# Altium project H743-Feedback.PrjPcb (part 3 of 3)

## Sheet zp_zh.SchDoc: Plate Voltage Source
size OrCAD A; DocumentNumber: FB-001; Revision: A; SheetNumber: 4; SheetTotal: 5
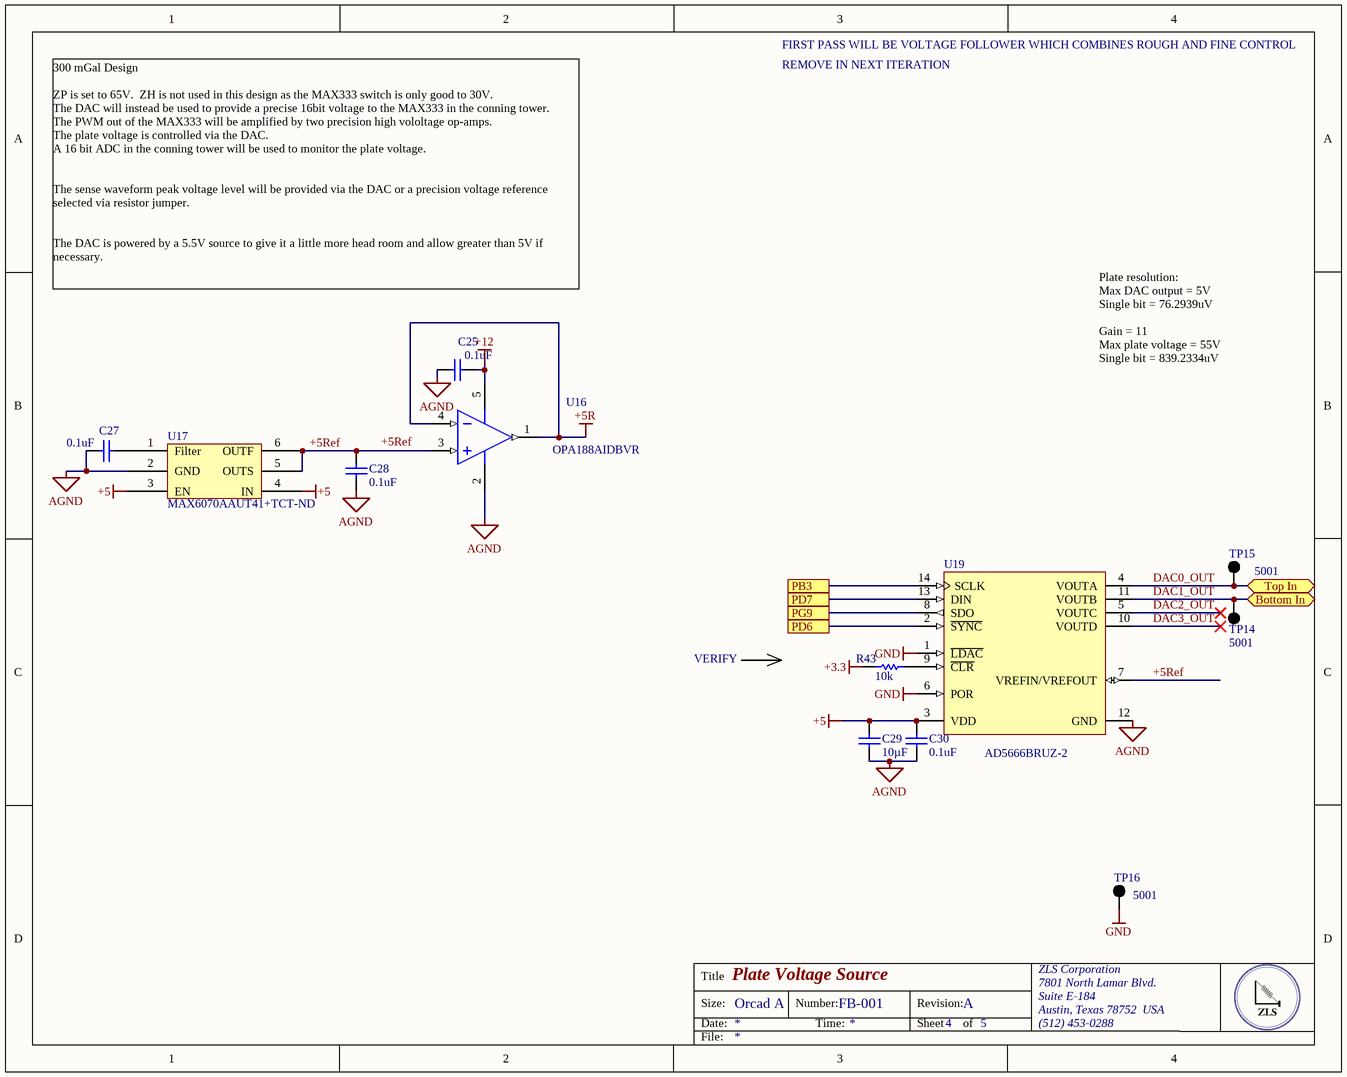
[diagram p3: zp_zh.SchDoc]

### Parts
C25  0.1uF  [CAPC0402(1005)60_L]
C27  0.1uF  [CAPC0402(1005)60_L]
C28  0.1uF  [CAPC0402(1005)60_L]
C29  Capacitance: 10µF  [CAPC0805(2012)145_N]  (hidden comment: 10uF)
C30  0.1uF  [CAPC0402(1005)60_L]
R43  10k  [RESC0402(1005)_M]
TP14  5001  [KSTN-5001]
TP15  5001  [KSTN-5001]
TP16  5001  [KSTN-5001]
U16  OPA188AIDBVR  [DBV0005A_M]
U17  Supplier Part Number 1: MAX6070AAUT41+TCT-ND  [SOT95P280X445-6N]  (hidden comment: MAX6070AAUT41+T)
U19  AD5666BRUZ-2  [RU-14_N]

### Ports
Bottom In (bidir), PB3, PD6, PD7, PG9, Top In (bidir)

### Nets
+3.3: R43.1
+5: C29.2 C30.1 U17.3(EN) U17.4(IN) U19.3(VDD)
+5R: U16.1(OUT) U16.4(IN-)
+12: C25.1 U16.5(V+)
AGND: C25.2 C27.2 C28.1 C29.1 C30.2 U16.2(V-) U17.2(GND) U19.12(GND)
GND: TP16.1 U19.1(~{LDAC}) U19.6(POR)
+5Ref: C28.2 U16.3(IN+) U17.5(OUTS) U17.6(OUTF) U19.7(VREFIN/VREFOUT)
DAC0_OUT: TP15.1 U19.4(VOUTA) ; port Top In
DAC1_OUT: TP14.1 U19.11(VOUTB) ; port Bottom In
DAC2_OUT: U19.5(VOUTC)
DAC3_OUT: U19.10(VOUTD)
PB3: U19.14(SCLK) ; port PB3
PD6: U19.2(~{SYNC}) ; port PD6
PD7: U19.13(DIN) ; port PD7
PG9: U19.8(SDO) ; port PG9
NetC27_1: C27.1 U17.1(Filter)
NetR43_2: R43.2 U19.9(~{CLR})

### Notes on the sheet
- FIRST PASS WILL BE VOLTAGE FOLLOWER WHICH COMBINES ROUGH AND FINE CONTROL
- REMOVE IN NEXT ITERATION
- 300 mGal Design
  ZP is set to 65V.  ZH is not used in this design as the MAX333 switch is only good to 30V.
  The DAC will instead be used to provide a precise 16bit voltage to the MAX333 in the conning tower.
  The PWM out of the MAX333 will be amplified by two precision high vololtage op-amps.
  The plate voltage is controlled via the DAC.
  A 16 bit ADC in the conning tower will be used to monitor the plate voltage.
  The sense waveform peak voltage level will be provided via the DAC or a precision voltage reference selected via resistor jumper.
  The DAC is powered by a 5.5V source to give it a little more head room and allow greater than 5V if necessary.
- Plate resolution:
  Max DAC output = 5V
  Single bit = 76.2939uV
  Gain = 11
  Max plate voltage = 55V
  Single bit = 839.2334uV
- VERIFY
- Labels drawn without touching a wire or pin: +5Ref
- Title
- Size:
- Date:
- Orcad A
- Number:
- Time:
- Revision:
- Sheet
- of
- ZLS Corporation
- 7801 North Lamar Blvd.
- Suite E-184
- Austin, Texas 78752  USA
- (512) 453-0288
- File:

### Library data of the parts
C25 C27 C28 C30 = CMP-1034-00252-1: CAP CER 0.1UF 10V X7R 0402; Manufacturer: Murata Electronics North America; Manufacturer Part Number: GRM155R71A104KA01D; Tolerance: ±10%; Supplier 1: Digi-Key; Supplier Part Number 1: 490-6321-1-ND; RoHS: RoHS Compliant; Category: Capacitors; Stock 1: 2920395; Pricing 1: 1=0.1, 10=0.014, 100=0.0063, 500=0.00446, 1000=0.00351, 2500=0.00319, 5000=0.00293 (USD); Packaging: Cut Tape (CT); Part Status: Active; Voltage - Rated: 10V; Temperature Coefficient: X7R; Operating Temperature: -55°C ~ 125°C; Features: -; Ratings: -; Applications: General Purpose; Mounting Type: Surface Mount, MLCC; Package / Case: 0402 (1005 Metric); Size / Dimension: 0.039" L x 0.020" W (1.00mm x 0.50mm); Height - Seated (Max): -; Thickness (Max): 0.022" (0.55mm); Lead Spacing: -; ComponentLink1URL: http://www.murata.com/~/media/webrenewal/support/library/catalog/products/capacitor/mlcc/c02e.ashx?la=en-us; ComponentLink1Description: http://www.murata.com/~/media/webrenewal/support/library/catalog/products/capacitor/mlcc/c02e.ashx?la=en-us
C29 = CMP-1036-04795-1: CAP CER 10UF 25V X7R 0805; Manufacturer: Murata Electronics North America; Manufacturer Part Number: GRM21BR71E104KA01L; Tolerance: ±10%; Supplier 1: Digi-Key; Supplier Part Number 1: 490-1673-6-ND; RoHS: RoHS Compliant; Category: Capacitors; Stock 1: 891652; Pricing 1: 1=0.2, 10=0.145, 100=0.0683, 500=0.04788, 1000=0.03964 (USD); Packaging: Digi-Reel®; Part Status: Active; Voltage - Rated: 25V; Temperature Coefficient: X7R; Operating Temperature: -55°C ~ 125°C; Features: -; Ratings: -; Applications: General Purpose; Mounting Type: Surface Mount, MLCC; Package / Case: 0805 (2012 Metric); Size / Dimension: 0.079" L x 0.049" W (2.00mm x 1.25mm); Height - Seated (Max): -; Thickness (Max): 0.053" (1.35mm); Lead Spacing: -; Lead Style: -; ComponentLink1URL: http://www.murata.com/~/media/webrenewal/support/library/catalog/products/capacitor/mlcc/c02e.ashx; ComponentLink1Description: http://www.murata.com/~/media/webrenewal/support/library/catalog/products/capacitor/mlcc/c02e.ashx
R43 = CMP-1011-00940-1: 10k 0.063W 1% 0402 (1005 Metric)  SMD; Manufacturer: Panasonic; Manufacturer Part Number: ERJ-2RKF1002X; Resistance: 10kR; Temperature Coefficient: 100ppm/°C; Power Rating: 100mW; Voltage Rating: 50V; Supplier 1: Digi-Key; Supplier Part Number 1: P10.0KLDKR-ND; Stock 1: 12501303; Pricing 1: 1=0.10000, 10=0.04500, 100=0.01830, 1000=0.00823, 2500=0.00715, 5000=0.00590 (USD); RoHS: Yes; Mount: Surface Mount; Case/Package: 0402; Number of Pins: 2; Case Code (Metric): 1005; Case Code (Imperial): 0402; Contact Plating: Tin; Min Operating Temperature: -55°C; Max Operating Temperature: 155°C; Tolerance: 1%; Packaging: Tape and Reel; Composition: Thick Film; Termination: SMD/SMT; Voltage Rating (DC): 50V; Package Quantity: 1; Number of Terminations: 2; Max Power Dissipation: 100mW; Military Standard: Not; Features: Automotive AEC-Q200; Length: 1mm; Height: 0.35mm; Width: 0.02inch; Depth: 0.5mm; Radiation Hardening: No; Lead Free: Lead Free; REACH SVHC: No SVHC; ComponentLink1URL: https://datasheet.ciiva.com/11821/0900766b80f80784-11821171.pdf?src-supplier=RSComponents; ComponentLink1Description: https://datasheet.ciiva.com/11821/0900766b80f80784-11821171.pdf?src-supplier=RSComponents; ComponentLink2URL: https://datasheet.ciiva.com/16199/aoa0000ce2-16199478.pdf?src-supplier=Future+Electronics; ComponentLink2Description: https://datasheet.ciiva.com/16199/aoa0000ce2-16199478.pdf?src-supplier=Future+Electronics; ComponentLink3URL: https://datasheet.ciiva.com/17212/aoa0000ce2-17212102.pdf?src-supplier=Avnet+Europe; ComponentLink3Description: https://datasheet.ciiva.com/17212/aoa0000ce2-17212102.pdf?src-supplier=Avnet+Europe; ComponentLink4URL: https://datasheet.ciiva.com/24023/aoa0000ce2-24023017.pdf?src-supplier=Mouser; ComponentLink4Description: https://datasheet.ciiva.com/24023/aoa0000ce2-24023017.pdf?src-supplier=Mouser; ComponentLink5URL: https://datasheet.ciiva.com/28514/1678782-28514185.pdf?src-supplier=Element14; ComponentLink5Description: https://datasheet.ciiva.com/28514/1678782-28514185.pdf?src-supplier=Element14; ComponentLink6URL: https://datasheet.ciiva.com/43467/1678782-43467402.pdf?src-supplier=Farnell; ComponentLink6Description: https://datasheet.ciiva.com/43467/1678782-43467402.pdf?src-supplier=Farnell; ComponentLink7URL: https://datasheet.ciiva.com/27055/1987020-27055643.pdf?src-supplier=Jameco; ComponentLink7Description: https://datasheet.ciiva.com/27055/1987020-27055643.pdf?src-supplier=Jameco; ComponentLink8URL: https://datasheet.ciiva.com/48531/aoa0000ce2-48531069.pdf?src-supplier=Avnet; ComponentLink8Description: https://datasheet.ciiva.com/48531/aoa0000ce2-48531069.pdf?src-supplier=Avnet; ComponentLink9URL: https://datasheet.ciiva.com/9194/aoa0000ce2-9194142.pdf?src-supplier=Avnet; ComponentLink9Description: https://datasheet.ciiva.com/9194/aoa0000ce2-9194142.pdf?src-supplier=Avnet; ComponentLink10URL: https://datasheet.ciiva.com/16782/70260748-16782590.pdf?src-supplier=Allied+Electronics; ComponentLink10Description: https://datasheet.ciiva.com/16782/70260748-16782590.pdf?src-supplier=Allied+Electronics; ComponentLink11URL: https://datasheet.ciiva.com/16786/70260748-16786734.pdf?src-supplier=Allied+Electronics; ComponentLink11Description: https://datasheet.ciiva.com/16786/70260748-16786734.pdf?src-supplier=Allied+Electronics; ComponentLink12URL: https://datasheet.ciiva.com/30201/aoa0000ce2-30201022.pdf?src-supplier=Onlinecomponents.com; ComponentLink12Description: https://datasheet.ciiva.com/30201/aoa0000ce2-30201022.pdf?src-supplier=Onlinecomponents.com
TP14-TP16 = CMP-2000-05181-1: Test Point, Black, 1-Pin THD, RoHS, Bulk; Manufacturer: Keystone; Other Names: 5001K; Catalog Drawings: 5000Series; Alternate Color: 5004K-ND / -TESTPOINTPCMINI.040"DYELLOW / 5003K-ND / -TESTPOINTPCMINI.040"DORANGE / 5002K-ND / -TESTPOINTPCMINI.040"DWHITE / 5000K-ND / -TESTPOINTPCMINI.040"DRED; Kits: DKTGRS232C-KIT-ND / -TTLCONVERTER; Online Catalog: ColorCodedTestPoints; Datasheet URL: https://ciiva.com/datasheet-click-2917627?src=ciiva&sig=bd195616; Mounting Type: 0.040"(1.02mm)HoleDiameter; Family: TestPoints; RoHS Information: RoHSComplianceStatement; Datasheet Version: Rev. G, 12/2008; Color: Black; Category: TestandMeasurement; Standard Package: 100; Manufacturer URL: http://www.keyelco.com/; Material: Base,Nylon46,UL94V-0; Type: PCTestPoint,Miniature; Terminal: 0.010"x0.020"(0.25mmx0.51mm)PhosphorBronzeWire,SilverPlated; Series: THM; Packaging: Bulk
U16 = CMP-0809-00005-2: Precision, Low Noise, Rail-to-Rail Output, Zero-Drift Operational Amplifier, 4 to 36 V, -40 to 125 degC, 5-pin SOT23 (DBV5), Green (RoHS & no Sb/Br); Manufacturer: Texas Instruments; Total Supply Voltage(Min)(+5V is 5, +/-5V is 10): 4; Offset Drift(Typ)(uV/C): 0.03; Rating: Catalog; SubFamily: Zero Drift Precision Amplifier; GBW(Typ)(MHz): 2; Slew Rate(Typ)(V/us): 0.8; Number of Channels: 1; CMRR(Min)(dB): 120; Iq per channel(Max)(mA): 0.51; Total Supply Voltage(Max)(+5V is 5, +/-5V is 10): 36; PartNumber: OPA188AIDBVR; ComponentLink2Description: Datasheet; ComponentLink2URL: http://www.ti.com/lit/ds/symlink/opa188.pdf; ComponentLink1Description: Manufacturer URL; Mounting Technology: Surface Mount; Eco-Plan: Green (RoHS & no Sb/Br); ComponentLink1URL: http://www.ti.com/; PackageVersion: 4073253-4/K, 03/2006; DatasheetVersion: SBOS642A; ComponentLink3Description: Package Specification; PackageReference: DBV0005A; ComponentLink3URL: http://www.ti.com/litv/pdf/mpds018i; PackageDescription: 5-Pin Plastic Small Outline, Body 1.6 x 2.9 mm, Pitch 0.95 mm; Code_JEDEC: MO-178
U17 = MAX6070AAUT41+T: IC VREF SERIES 4.096V SOT23; Manufacturer: Maxim Integrated; Output Type: Fixed; Tolerance: ±0.04%; Temperature Coefficient: 6ppm/°C; Noise - 0.1Hz to 10Hz: 9.6µVp-p; Noise - 10Hz to 10kHz: 9µVrms; Voltage - Input: 4.3 V ~ 5.5 V; Current - Supply: 350µA; Supplier 1: Digi-Key; Manufacturer Part Number: MAX6070AAUT41+T; RoHS: RoHS Compliant; Category: Integrated Circuits (ICs); Stock 1: 2623; Pricing 1: 1=3.41, 10=3.213, 25=2.5704, 50=2.4418, 100=2.2491, 250=2.13344, 500=2.05634 (USD); Packaging: Cut Tape (CT); Part Status: Active; Reference Type: Series; Voltage - Output (Min/Fixed): 4.096V; Operating Temperature: -40°C ~ 125°C (TA); Mounting Type: Surface Mount; Package / Case: SOT-23-6; Supplier Device Package: SOT-23-6; ComponentLink1URL: https://datasheets.maximintegrated.com/en/ds/MAX6070-MAX6071.pdf; ComponentLink1Description: https://datasheets.maximintegrated.com/en/ds/MAX6070-MAX6071.pdf
U19 = CMP-0318-01541-2: Quad 16-Bit Digital-to-Analog Converter with 5 ppm/degC On-Chip Reference, -40 to +105 degC, RU-14, Pb-Free, Tube; Generic Part Number: AD5666; Manufacturer: Analog Devices; Max V+: 5.5V; Op Pwr Diss: 12.5mW; Settling Time: 6Âµs; Resolution (Bits): 16; Single Supply: Yes; # DAC Outputs: 4; Mounting Technology: Surface Mount; ComponentLink3URL: http://www.analog.com/static/imported-files/packages/36057385283879153717235186773RU14.pdf; ComponentLink2Description: Datasheet; Packing: Tube; PackageVersion: Aug-2002; ComponentLink4Description: Product URL; ComponentLink1Description: Manufacturer URL; PartNumber: AD5666BRUZ-2; PackageReference: RU-14; Code_JEDEC: MO-153-AB-1; ComponentLink2URL: http://www.analog.com/static/imported-files/data_sheets/AD5666.pdf; ComponentLink4URL: http://www.analog.com/en/digital-to-analog-converters/da-converters/ad5666/products/product.html; PackageDescription: 14-Lead Thin Shrink Small Outline Package [TSSOP]; DatasheetVersion: Rev.D; RoHS: Y; ComponentLink1URL: http://www.analog.com/en/index.html; ComponentLink3Description: Package Specification; RevisionNote: Component URL fixed

## Sheet ADC.SchDoc: ADC
size OrCAD A; DocumentNumber: FB-001; Revision: A; SheetNumber: 5; SheetTotal: 5
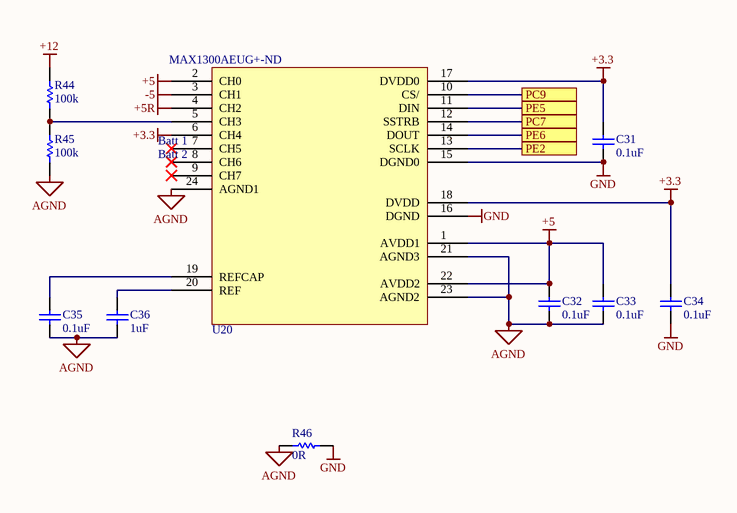
[diagram p4: ADC.SchDoc]

### Parts
C31  0.1uF  [CAPC0402(1005)60_L]
C32  0.1uF  [CAPC0402(1005)60_L]
C33  0.1uF  [CAPC0402(1005)60_L]
C34  0.1uF  [CAPC0402(1005)60_L]
C35  0.1uF  [CAPC0402(1005)60_L]
C36  1uF  [CAPC0402(1005)60_L]
R44  100k  [RESC0402(1005)_M]
R45  100k  [RESC0402(1005)_M]
R46  0R  [RESC1005X40X25NL05T10]
U20  Supplier Part Number 1: MAX1300AEUG+-ND  [MAX1300]  (hidden comment: MAX1300)

### Ports
PC7, PC9, PE2, PE5, PE6

### Nets
+3.3: C31.2 C34.2 U20.6(CH4) U20.17(DVDD0) U20.18(DVDD)
+5: C32.2 C33.2 U20.1(AVDD1) U20.2(CH0) U20.22(AVDD2)
+5R: U20.4(CH2)
+12: R44.2
-5: U20.3(CH1)
AGND: C32.1 C33.1 C35.1 C36.1 R45.1 R46.1 U20.21(AGND3) U20.23(AGND2) U20.24(AGND1)
GND: C31.1 C34.1 R46.2 U20.15(DGND0) U20.16(DGND)
PC7: U20.12(SSTRB) ; port PC7
PC9: U20.10(CS/) ; port PC9
PE2: U20.13(SCLK) ; port PE2
PE5: U20.11(DIN) ; port PE5
PE6: U20.14(DOUT) ; port PE6
NetC35_2: C35.2 U20.19(REFCAP)
NetC36_2: C36.2 U20.20(REF)
NetR44_1: R44.1 R45.2 U20.5(CH3)

Not connected (* = marked no-connect by the designer): U20 7(CH5)* 8(CH6)* 9(CH7)*

### Notes on the sheet
- (near U20) Batt 1
- (near U20) Batt 2
- Title
- Size:
- Date:
- Orcad A
- Number:
- Time:
- Revision:
- Sheet
- of
- ZLS Corporation
- 7801 North Lamar Blvd.
- Suite E-184
- Austin, Texas 78752  USA
- (512) 453-0288
- File:

### Library data of the parts
C31-C35 = CMP-1034-00252-1: as C25 on sheet zp_zh; Supplier 1: Digi-Key; Supplier Part Number 1: 490-6321-1-ND; RoHS: RoHS Compliant; Category: Capacitors; Stock 1: 2920395; Pricing 1: 1=0.1, 10=0.014, 100=0.0063, 500=0.00446, 1000=0.00351, 2500=0.00319, 5000=0.00293 (USD); Packaging: Cut Tape (CT); Part Status: Active; Voltage - Rated: 10V; Temperature Coefficient: X7R; Operating Temperature: -55°C ~ 125°C; Features: -; Ratings: -; Applications: General Purpose; Mounting Type: Surface Mount, MLCC; Package / Case: 0402 (1005 Metric); Size / Dimension: 0.039" L x 0.020" W (1.00mm x 0.50mm); Height - Seated (Max): -; Thickness (Max): 0.022" (0.55mm); Lead Spacing: -; ComponentLink1URL: http://www.murata.com/~/media/webrenewal/support/library/catalog/products/capacitor/mlcc/c02e.ashx?la=en-us; ComponentLink1Description: http://www.murata.com/~/media/webrenewal/support/library/catalog/products/capacitor/mlcc/c02e.ashx?la=en-us
C36 = CMP-1034-00252-1: 1µF ±10% 16V Ceramic Capacitor X5R 0402 (1005 Metric); Manufacturer: Samsung; Manufacturer Part Number: CL05A105KO5NNNC; Supplier 1: Future Electronics; Supplier Part Number 1: CL05A105KO5NNNC-CUTT; Stock 1: 8167; Pricing 1: 1=0.0074, 500=0.0064, 1500=0.0062, 2500=0.0061, 5000=0.006 (USD); Mount: Surface Mount; Case/Package: 0402; Case Code (Metric): 1005; Case Code (Imperial): 0402; Contact Plating: Tin; Min Operating Temperature: -55°C; Max Operating Temperature: 85°C; Tolerance: 10%; Capacitance: 1uF; Dielectric: X5R; Packaging: Tape and Reel; Package Quantity: 1; Voltage Rating: 16V; Voltage: 16V; Length: 1mm; Height: 0.5mm; Width: 0.02inch; Thickness: 0.022inch; Depth: 0.5mm; Radiation Hardening: No; ComponentLink1URL: http://www1.futureelectronics.com/doc/SAMSUNG/CL05A105KO5NNNC.pdf?src-supplier=Future+Electronics; ComponentLink1Description: http://www1.futureelectronics.com/doc/SAMSUNG/CL05A105KO5NNNC.pdf?src-supplier=Future+Electronics; ComponentLink2URL: https://www.verical.com/server-webapp/html/getDatasheet?partID=355272&src-supplier=Verical; ComponentLink2Description: https://www.verical.com/server-webapp/html/getDatasheet?partID=355272&src-supplier=Verical
R44 R45 = CMP-1011-00940-1: 100k 0.063W 1% 0402 (1005 Metric)  SMD; Manufacturer: Panasonic; Manufacturer Part Number: ERJ-2RKF1003X; Resistance: 100kR; Power Rating: 100mW; Temperature Coefficient: 100ppm/°C; Voltage Rating: 50V; Supplier 1: Digi-Key; Supplier Part Number 1: P100KLCT-ND; Stock 1: 9533476; Pricing 1: 1=0.10000, 10=0.04500, 100=0.01830, 1000=0.00823, 2500=0.00715, 5000=0.00590 (USD); RoHS: Yes; Mount: Surface Mount; Case/Package: 0402; Number of Pins: 2; Case Code (Imperial): 0402; Case Code (Metric): 1005; Contact Plating: Tin; Min Operating Temperature: -55°C; Max Operating Temperature: 155°C; Tolerance: 1%; Packaging: Tape and Reel; Composition: Thick Film; Voltage Rating (DC): 50V; Termination: SMD/SMT; Military Standard: Not; Package Quantity: 1; Number of Terminations: 2; Max Power Dissipation: 100mW; Features: Automotive AEC-Q200; Length: 1mm; Height: 0.35mm; Width: 0.5mm; Depth: 0.5mm; Radiation Hardening: No; Lead Free: Lead Free; REACH SVHC: No SVHC; ComponentLink1URL: https://datasheet.ciiva.com/11821/0900766b80f80784-11821175.pdf?src-supplier=RSComponents; ComponentLink1Description: https://datasheet.ciiva.com/11821/0900766b80f80784-11821175.pdf?src-supplier=RSComponents; ComponentLink2URL: https://datasheet.ciiva.com/34303/1987038-34303550.pdf?src-supplier=Jameco; ComponentLink2Description: https://datasheet.ciiva.com/34303/1987038-34303550.pdf?src-supplier=Jameco; ComponentLink3URL: https://datasheet.ciiva.com/7830/aoa0000ce2-7830725.pdf?src-supplier=Element14; ComponentLink3Description: https://datasheet.ciiva.com/7830/aoa0000ce2-7830725.pdf?src-supplier=Element14; ComponentLink4URL: https://datasheet.ciiva.com/16522/aoa0000ce2-16522647.pdf?src-supplier=Avnet+Asia; ComponentLink4Description: https://datasheet.ciiva.com/16522/aoa0000ce2-16522647.pdf?src-supplier=Avnet+Asia; ComponentLink5URL: https://datasheet.ciiva.com/16778/70260748-16778055.pdf?src-supplier=Allied+Electronics; ComponentLink5Description: https://datasheet.ciiva.com/16778/70260748-16778055.pdf?src-supplier=Allied+Electronics; ComponentLink6URL: https://datasheet.ciiva.com/43467/1678782-43467480.pdf?src-supplier=Farnell; ComponentLink6Description: https://datasheet.ciiva.com/43467/1678782-43467480.pdf?src-supplier=Farnell; ComponentLink7URL: https://datasheet.ciiva.com/16440/aoa0000ce2-16440217.pdf?src-supplier=Future+Electronics; ComponentLink7Description: https://datasheet.ciiva.com/16440/aoa0000ce2-16440217.pdf?src-supplier=Future+Electronics; ComponentLink8URL: https://datasheet.ciiva.com/30245/aoa0000ce2-30245691.pdf?src-supplier=Onlinecomponents.com; ComponentLink8Description: https://datasheet.ciiva.com/30245/aoa0000ce2-30245691.pdf?src-supplier=Onlinecomponents.com; ComponentLink9URL: https://datasheet.ciiva.com/7830/426256-7830974.pdf?src-supplier=Element14; ComponentLink9Description: https://datasheet.ciiva.com/7830/426256-7830974.pdf?src-supplier=Element14; ComponentLink10URL: https://datasheet.ciiva.com/16784/70260748-16784190.pdf?src-supplier=Allied+Electronics; ComponentLink10Description: https://datasheet.ciiva.com/16784/70260748-16784190.pdf?src-supplier=Allied+Electronics; ComponentLink11URL: https://datasheet.ciiva.com/22723/426256-22723902.pdf?src-supplier=Element14; ComponentLink11Description: https://datasheet.ciiva.com/22723/426256-22723902.pdf?src-supplier=Element14; ComponentLink12URL: https://datasheet.ciiva.com/48531/aoa0000ce2-48531070.pdf?src-supplier=Avnet; ComponentLink12Description: https://datasheet.ciiva.com/48531/aoa0000ce2-48531070.pdf?src-supplier=Avnet; ComponentLink13URL: https://datasheet.ciiva.com/9186/aoa0000ce2-9186687.pdf?src-supplier=Avnet; ComponentLink13Description: https://datasheet.ciiva.com/9186/aoa0000ce2-9186687.pdf?src-supplier=Avnet
R46 = CMP-2002-07912-1: RES SMD 0 OHM JUMPER 1/16W 0402; Manufacturer: Yageo / Phycomp; Part Number: RC0402JR-070RL; Resistance: 0mR; Voltage Rating: 50V; Temperature Coefficient: 200ppm/°C; Tolerance: 5%; Power Rating: 62.5mW; Max Power Dissipation: 63mW; Supplier 1: Digi-Key; Supplier Part Number 1: 311-0.0JRCT-ND; Manufacturer Part Number: RC0402JR-070RL; Stock 1: 75833567; Pricing 1: 1=0.10000, 10=0.01500, 25=0.01080, 50=0.00800, 100=0.00600, 250=0.00456, 500=0.00364, 1000=0.00268, 5000=0.00192 (USD); RoHS: Yes; Case/Package: 0402; Case Code (Metric): 1005; Case Code (Imperial): 0402; Contact Plating: Tin,Matte; Min Operating Temperature: -55°C; Max Operating Temperature: 155°C; Packaging: Tape and Reel; Termination: SMD/SMT; Military Standard: Not; Package Quantity: 1; Composition: Thick Film; Number of Terminations: 2; Features: Moisture Resistant; Length: 1mm; Height: 0.016inch; Width: 0.02inch; Depth: 0.5mm; Radiation Hardening: No; REACH SVHC: Unknown; Lead Free: Lead Free; ComponentLink1URL: https://datasheet.ciiva.com/2452/pyu-rc0402-51-rohs-l-6-2452608.pdf?src-supplier=Digi-Key; ComponentLink1Description: https://datasheet.ciiva.com/2452/pyu-rc0402-51-rohs-l-6-2452608.pdf?src-supplier=Digi-Key; ComponentLink2URL: https://datasheet.ciiva.com/11808/0900766b80c66297-11808195.pdf?src-supplier=RSComponents; ComponentLink2Description: https://datasheet.ciiva.com/11808/0900766b80c66297-11808195.pdf?src-supplier=RSComponents; ComponentLink3URL: https://datasheet.ciiva.com/8896/pyu-rc0402-51-rohs-l-6-8896201.pdf?src-supplier=Avnet; ComponentLink3Description: https://datasheet.ciiva.com/8896/pyu-rc0402-51-rohs-l-6-8896201.pdf?src-supplier=Avnet; ComponentLink4URL: https://datasheet.ciiva.com/28386/pyu-rc0402-51-rohs-l-6-28386633.pdf?src-supplier=Avnet+Europe; ComponentLink4Description: https://datasheet.ciiva.com/28386/pyu-rc0402-51-rohs-l-6-28386633.pdf?src-supplier=Avnet+Europe; ComponentLink5URL: https://datasheet.ciiva.com/7983/1018594-7983535.pdf?src-supplier=Element14; ComponentLink5Description: https://datasheet.ciiva.com/7983/1018594-7983535.pdf?src-supplier=Element14; ComponentLink6URL: https://datasheet.ciiva.com/2452/pyu-r-int-thick-7-2452609.pdf?src-supplier=Digi-Key; ComponentLink6Description: https://datasheet.ciiva.com/2452/pyu-r-int-thick-7-2452609.pdf?src-supplier=Digi-Key; ComponentLink7URL: https://datasheet.ciiva.com/2452/pyu-r-int-thick-7-2452610.pdf?src-supplier=Digi-Key; ComponentLink7Description: https://datasheet.ciiva.com/2452/pyu-r-int-thick-7-2452610.pdf?src-supplier=Digi-Key; ComponentLink8URL: https://datasheet.ciiva.com/22747/1018594-22747515.pdf?src-supplier=Element14; ComponentLink8Description: https://datasheet.ciiva.com/22747/1018594-22747515.pdf?src-supplier=Element14; ComponentLink9URL: https://datasheet.ciiva.com/15189/getdatasheetpartid-326379-15189533.pdf?src-supplier=Verical; ComponentLink9Description: https://datasheet.ciiva.com/15189/getdatasheetpartid-326379-15189533.pdf?src-supplier=Verical
U20 = MAX1300: Manufacturer: Maxim; Manufacturer Part Number: MAX1300AEUG+; Description: IC ADC 16BIT SRL 115KSPS 24TSSOP; Number of Bits: 16; Sampling Rate: 115KS/s; Interface: SPI,Serial; Number of A/D Converters: 1; Resolution: 16b; Polarity: Bipolar,Unipolar; Max Power Dissipation: 976mW; Supply Type: Analog,Digital; Signal to Noise Ratio (SNR): 91dB; Min Supply Voltage: 2.7V; Max Supply Voltage: 5.25V; Supplier 1: Digi-Key; Stock 1: 302; Pricing 1: 1=13.94000, 10=12.85900, 25=12.38400 (USD); RoHS: Yes; Mount: Surface Mount; Case/Package: TSSOP; Number of Pins: 24; Min Operating Temperature: -40°C; Max Operating Temperature: 85°C; Packaging: Rail/Tube; Package Quantity: 62; Number of Converters: 1; Conversion Rate: 115KS/s; Radiation Hardening: No; REACH SVHC: Unknown; ComponentLink1URL: https://datasheet.ciiva.com/4774/max1300-max1301-78820-4774000.pdf?src-supplier=Mouser; ComponentLink1Description: https://datasheet.ciiva.com/4774/max1300-max1301-78820-4774000.pdf?src-supplier=Mouser; ComponentLink2URL: https://datasheet.ciiva.com/1276/max1300-max1301-1276229.pdf?src-supplier=Digi-Key; ComponentLink2Description: https://datasheet.ciiva.com/1276/max1300-max1301-1276229.pdf?src-supplier=Digi-Key; ComponentLink3URL: https://datasheet.ciiva.com/16610/max1300-max1301-16610998.pdf?src-supplier=Avnet+Europe; ComponentLink3Description: https://datasheet.ciiva.com/16610/max1300-max1301-16610998.pdf?src-supplier=Avnet+Europe; ComponentLink4URL: https://datasheet.ciiva.com/3039/max1300-max1301-3039099.pdf?src-supplier=Avnet; ComponentLink4Description: https://datasheet.ciiva.com/3039/max1300-max1301-3039099.pdf?src-supplier=Avnet

## Nets that join several sheets
+3.3: Connectors (CN1.1 CN1.3 CN2.1 CN2.3), CT (C8.2 C9.2 U5.5 U6.5), Feedback (6 pins), zp_zh (R43.1), ADC (5 pins)
+5: Connectors (CN1.5 CN1.7 CN2.5 CN2.7), CT (C2.2 C5.2 U1.16 U4.8), Feedback (C12.2 R19.2 U8.5), zp_zh (5 pins), ADC (5 pins)
+5R: Connectors (CN1.6 CN1.8), Feedback (5 pins), zp_zh (U16.1 U16.4), ADC (U20.4)
+12: Connectors (CN2.2 CN2.4), Feedback (6 pins), zp_zh (C25.1 U16.5), ADC (R44.2)
-5: Connectors (CN2.6 CN2.8), CT (U4.4), Feedback (C15.2 C16.2 U7.5 U8.2), ADC (U20.3)
AGND: Connectors (CN2.40), Feedback (8 pins), zp_zh (8 pins), ADC (9 pins)
GND: Connectors (11 pins), CT (32 pins), Feedback (22 pins), zp_zh (TP16.1 U19.1 U19.6), ADC (5 pins)
ZSupply: Connectors (CN1.2 CN1.4), CT (C1.1 C3.1 U2.8 U3.8)
BEAM: CT (C6.2 R11.2 TP6.1), Feedback (U7.14)
Bottom Sense Plate Force: CT (J1.7), Feedback (R39.2 R40.2 TP13.1)
Bottom Sense Plate Sense: CT (J1.8), Feedback (U13.3)
DAC0_OUT: CT (U1.17), zp_zh (TP15.1 U19.4)
DAC1_OUT: CT (U1.12), zp_zh (TP14.1 U19.11)
PA4: Connectors (CN1.40), CT (U5.1 U5.4)
PA5: Connectors (CN2.19), Feedback (U12.1 U12.4)
PA6: Connectors (CN2.21), Feedback (U14.1 U14.4)
PB1: Connectors (CN2.32), CT (U6.1 U6.4)
PB3: Connectors (CN2.39), zp_zh (U19.14)
PB10: Connectors (CN2.33), Feedback (U11.2)
PC2_C: Connectors (CN1.43), Feedback (U11.4)
PC3_C: Connectors (CN1.45), Feedback (U11.3)
PC7: Connectors (CN2.27), ADC (U20.12)
PC9: Connectors (CN2.9), ADC (U20.10)
PD6: Connectors (CN1.53), zp_zh (U19.2)
PD7: Connectors (CN1.55), zp_zh (U19.13)
PE2: Connectors (CN1.56), ADC (U20.13)
PE5: Connectors (CN1.60), ADC (U20.11)
PE6: Connectors (CN1.72), ADC (U20.14)
PE9: Connectors (CN2.62), Feedback (R23.2)
PE11: Connectors (CN2.66), Feedback (R25.2)
PE13: Connectors (CN2.65), CT (R6.2 TP1.1 U1.11 U1.20)
PF11: Connectors (CN2.72), Feedback (U9.1 U9.4)
PF14: Connectors (CN2.60), Feedback (U11.14)
PG9: Connectors (CN1.73), zp_zh (U19.8)
Top Sense Plate Force: CT (J1.5), Feedback (R29.2 R31.2 TP11.1)
Top Sense Plate Sense: CT (J1.6), Feedback (U10.3)

## Assembly variants
100mGal: not fitted CN2 R35
300mGal: not fitted CN2 R35 R40 R41 R42 R44 R45 U15 U16 U17